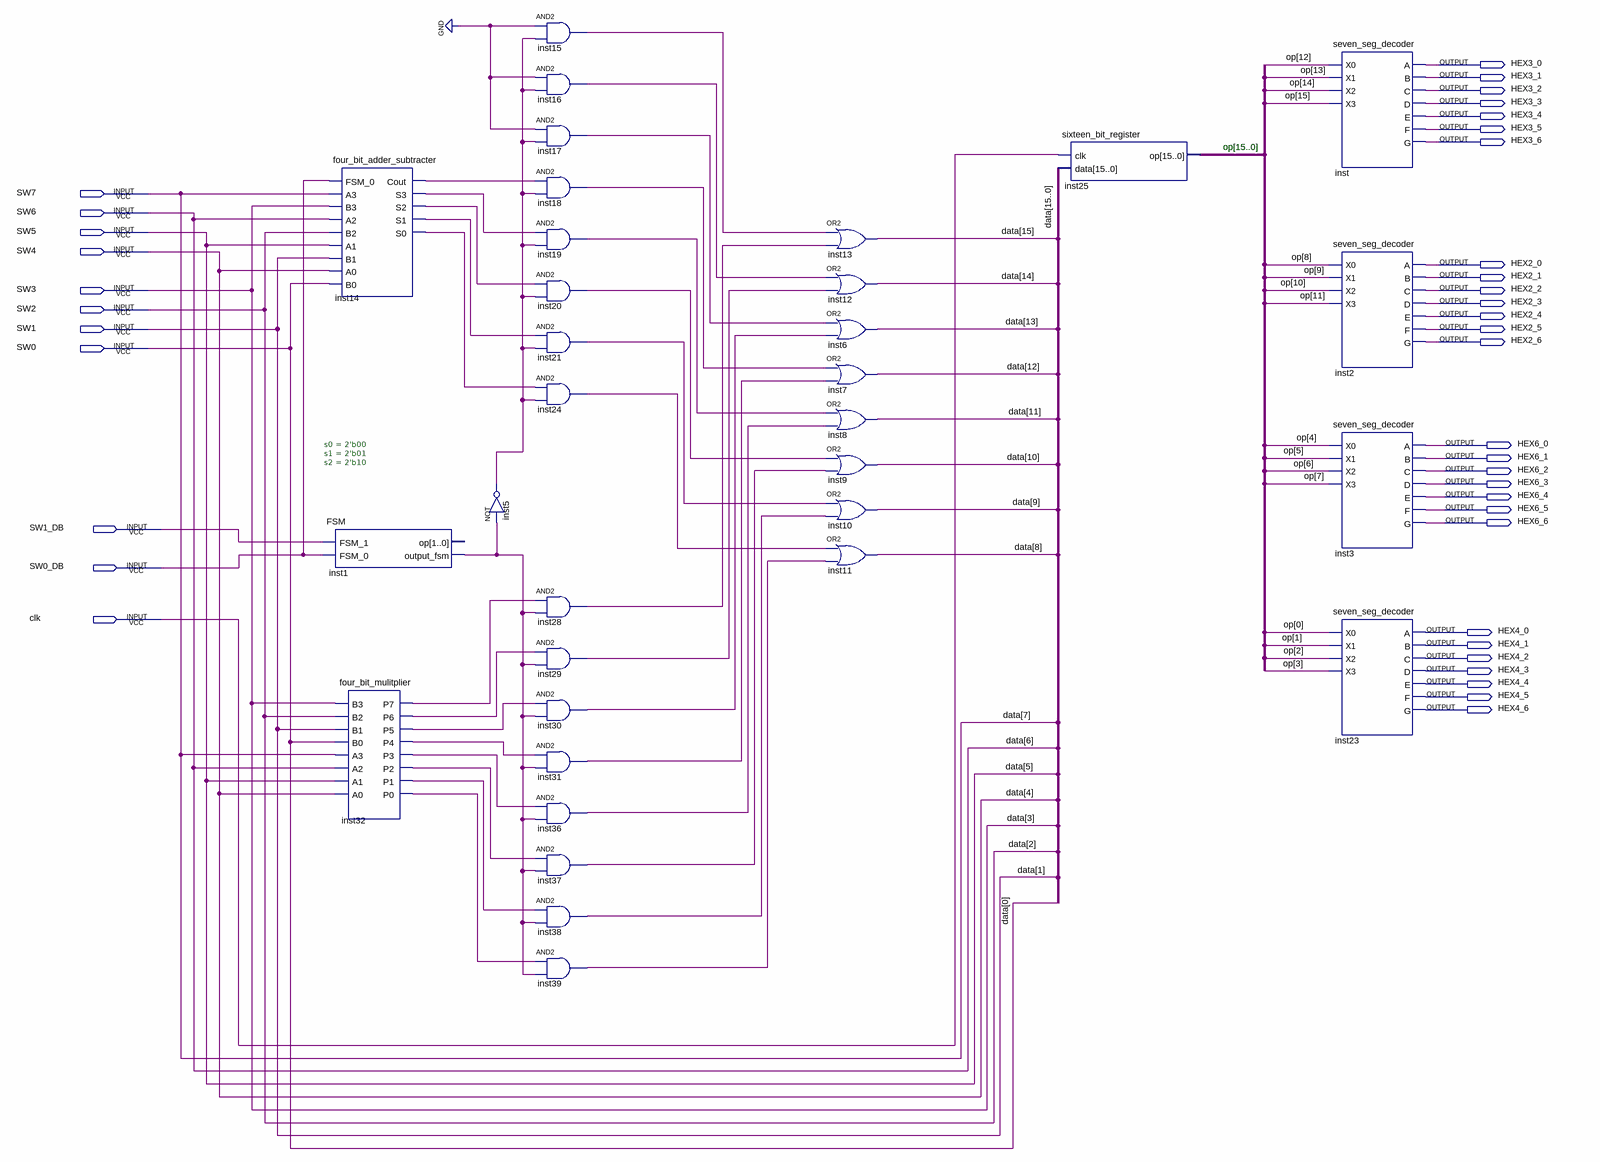
[diagram p0: schematic sheet]
// Quartus schematic final_calculator.bdf as structural Verilog: 33 symbols, 39 pins
module final_calculator (
  input  SW7,
  input  SW6,
  input  SW5,
  input  SW4,
  input  SW3,
  input  SW2,
  input  SW1,
  input  SW0,
  input  SW1_DB,
  input  SW0_DB,
  input  clk,
  output HEX3_0,
  output HEX3_1,
  output HEX3_2,
  output HEX3_3,
  output HEX3_4,
  output HEX3_5,
  output HEX3_6,
  output HEX2_0,
  output HEX2_1,
  output HEX2_2,
  output HEX2_3,
  output HEX2_4,
  output HEX2_5,
  output HEX2_6,
  output HEX6_0,
  output HEX6_1,
  output HEX6_2,
  output HEX6_3,
  output HEX6_4,
  output HEX6_5,
  output HEX6_6,
  output HEX4_0,
  output HEX4_1,
  output HEX4_2,
  output HEX4_3,
  output HEX4_4,
  output HEX4_5,
  output HEX4_6
);

  wire inst1_output_fsm, inst5_out, inst14_cout, inst14_s0, inst14_s1, inst14_s2, inst14_s3, inst15_out,
       inst16_out, inst17_out, inst18_out, inst19_out, inst20_out, inst21_out, inst24_out, inst28_out,
       inst29_out, inst30_out, inst31_out, inst32_p0, inst32_p1, inst32_p2, inst32_p3, inst32_p4, inst32_p5,
       inst32_p6, inst32_p7, inst36_out, inst37_out, inst38_out, inst39_out;
  wire [15:0] op;
  wire [15:8] data;

  four_bit_adder_subtracter inst14 (
    .FSM_0(SW0_DB), .A3(SW7), .B3(SW3), .A2(SW6), .B2(SW2), .A1(SW5), .B1(SW1), .A0(SW4), .B0(SW0),
    .Cout(inst14_cout), .S3(inst14_s3), .S2(inst14_s2), .S1(inst14_s1), .S0(inst14_s0));
  FSM #(.s0(2'b00), .s1(2'b01), .s2(2'b10)) inst1 (
    .FSM_1(SW1_DB), .FSM_0(SW0_DB), .output_fsm(inst1_output_fsm));  // open: op
  four_bit_mulitplier inst32 (
    .B3(SW3), .B2(SW2), .B1(SW1), .B0(SW0), .A3(SW7), .A2(SW6), .A1(SW5), .A0(SW4), .P7(inst32_p7),
    .P6(inst32_p6), .P5(inst32_p5), .P4(inst32_p4), .P3(inst32_p3), .P2(inst32_p2), .P1(inst32_p1),
    .P0(inst32_p0));
  not inst5 (inst5_out, inst1_output_fsm);
  and inst15 (inst15_out, 1'b0, inst5_out);
  and inst16 (inst16_out, 1'b0, inst5_out);
  and inst17 (inst17_out, 1'b0, inst5_out);
  and inst18 (inst18_out, inst14_cout, inst5_out);
  and inst19 (inst19_out, inst14_s3, inst5_out);
  and inst20 (inst20_out, inst14_s2, inst5_out);
  and inst21 (inst21_out, inst14_s1, inst5_out);
  and inst24 (inst24_out, inst14_s0, inst5_out);
  and inst28 (inst28_out, inst32_p7, inst1_output_fsm);
  and inst29 (inst29_out, inst32_p6, inst1_output_fsm);
  and inst30 (inst30_out, inst32_p5, inst1_output_fsm);
  and inst31 (inst31_out, inst32_p4, inst1_output_fsm);
  and inst36 (inst36_out, inst32_p3, inst1_output_fsm);
  and inst37 (inst37_out, inst32_p2, inst1_output_fsm);
  and inst38 (inst38_out, inst32_p1, inst1_output_fsm);
  and inst39 (inst39_out, inst32_p0, inst1_output_fsm);
  or inst13 (data[15], inst15_out, inst28_out);
  or inst12 (data[14], inst16_out, inst29_out);
  or inst6 (data[13], inst17_out, inst30_out);
  or inst7 (data[12], inst18_out, inst31_out);
  or inst8 (data[11], inst19_out, inst36_out);
  or inst9 (data[10], inst20_out, inst37_out);
  or inst10 (data[9], inst21_out, inst38_out);
  or inst11 (data[8], inst24_out, inst39_out);
  sixteen_bit_register inst25 (.clk(clk), .data({data, SW7, SW6, SW5, SW4, SW3, SW2, SW1, SW0}), .op(op));
  seven_seg_decoder inst (
    .X0(op[12]), .X1(op[13]), .X2(op[14]), .X3(op[15]), .A(HEX3_0), .B(HEX3_1), .C(HEX3_2), .D(HEX3_3),
    .E(HEX3_4), .F(HEX3_5), .G(HEX3_6));
  seven_seg_decoder inst2 (
    .X0(op[8]), .X1(op[9]), .X2(op[10]), .X3(op[11]), .A(HEX2_0), .B(HEX2_1), .C(HEX2_2), .D(HEX2_3),
    .E(HEX2_4), .F(HEX2_5), .G(HEX2_6));
  seven_seg_decoder inst3 (
    .X0(op[4]), .X1(op[5]), .X2(op[6]), .X3(op[7]), .A(HEX6_0), .B(HEX6_1), .C(HEX6_2), .D(HEX6_3),
    .E(HEX6_4), .F(HEX6_5), .G(HEX6_6));
  seven_seg_decoder inst23 (
    .X0(op[0]), .X1(op[1]), .X2(op[2]), .X3(op[3]), .A(HEX4_0), .B(HEX4_1), .C(HEX4_2), .D(HEX4_3),
    .E(HEX4_4), .F(HEX4_5), .G(HEX4_6));

  // Other names for the same wires on the sheet: data[7:0] = {SW7, SW6, SW5, SW4, SW3, SW2, SW1, SW0}

  // Notes on the sheet:
  //   op[15..0]
endmodule
